# EAGLE design TinyBuddy-rev2 (EAGLE 6.5.0)
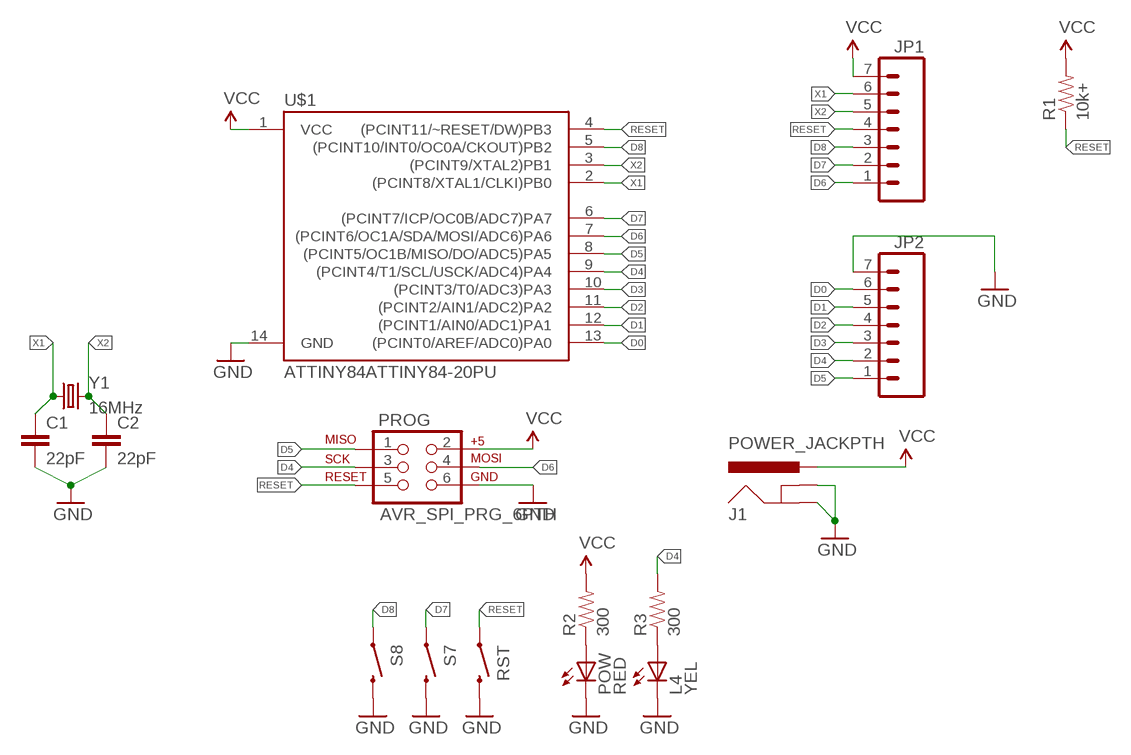
[diagram p0: schematic, sheet 1]

## Parts
C1  22pF  CAPPTH  [CAP-PTH-SMALL]
C2  22pF  CAPPTH  [CAP-PTH-SMALL]
J1  POWER_JACKPTH  [POWER_JACK_PTH]
JP1  M07NOSILK  [1X07_NOSILK]
JP2  M07NOSILK  [1X07_NOSILK]
L4  YEL  LED3MM  [LED3MM]
POW  RED  LED3MM  [LED3MM]
PROG  AVR_SPI_PRG_6PTH  [2X3]
R1  10k+  RESISTORPTH-1/6W  [1/6W-RES]
R2  300  RESISTORPTH-1/6W  [1/6W-RES]
R3  300  RESISTORPTH-1/6W  [1/6W-RES]
RST  SWITCH-MOMENTARY-2PTH  [TACTILE-PTH]
S7  SWITCH-MOMENTARY-2PTH  [TACTILE-PTH]
S8  SWITCH-MOMENTARY-2PTH  [TACTILE-PTH]
U$1  ATTINY84ATTINY84-20PU  [DIL14]
Y1  16MHz  CRYSTALHC49US  [HC49US]

## Nets
D0: JP2.6 U$1.13((PCINT0/AREF/ADC0)PA0)
D1: JP2.5 U$1.12((PCINT1/AIN0/ADC1)PA1)
D2: JP2.4 U$1.11((PCINT2/AIN1/ADC2)PA2)
D3: JP2.3 U$1.10((PCINT3/T0/ADC3)PA3)
D4: JP2.2 PROG.3 R3.2 U$1.9((PCINT4/T1/SCL/USCK/ADC4)PA4)
D5: JP2.1 PROG.1 U$1.8((PCINT5/OC1B/MISO/DO/ADC5)PA5)
D6: JP1.1 PROG.4 U$1.7((PCINT6/OC1A/SDA/MOSI/ADC6)PA6)
D7: JP1.2 S7.1 U$1.6((PCINT7/ICP/OC0B/ADC7)PA7)
D8: JP1.3 S8.1 U$1.5((PCINT10/INT0/OC0A/CKOUT)PB2)
GND: C1.2 C2.2 J1.GND J1.GNDBREAK JP2.7 L4.K(C) POW.K(C) PROG.6 RST.3 S7.3 S8.3 U$1.14(GND)
N$1: POW.A R2.1
N$2: L4.A R3.1
RESET: JP1.4 PROG.5 R1.1 RST.1 U$1.4((PCINT11/~RESET/DW)PB3)
VCC: J1.PWR JP1.7 PROG.2 R1.2 R2.2 U$1.1(VCC)
X1: C1.1 JP1.6 U$1.2((PCINT8/XTAL1/CLKI)PB0) Y1.1
X2: C2.1 JP1.5 U$1.3((PCINT9/XTAL2)PB1) Y1.2

## Library data of the parts
C1 C2 = SparkFun-Capacitors:CAP: Capacitor Standard 0603 ceramic capacitor, and 0.1" leaded capacitor.
J1 = SparkFun-Connectors:POWER_JACK: Power Jack This is the standard 5.5mm barrel jack for power. The PTH is the most common, proven, reliable, footprint. The Slot footprint only works if the mill layer is transmitted to the PCB fab house so be warned. Mating wall wart : TOL-00298 (and others); PROD_ID: PRT-00119
JP1 JP2 = SparkFun-Connectors:M07: Header 7 Standard 7-pin 0.1" header. Use with straight break away headers (SKU : PRT-00116), right angle break away headers (PRT-00553), swiss pins (PRT-00743), machine pins (PRT-00117), and female headers (PRT-00115). NOTES ON THE VARIANTS LOCK and LOCK_LONGPADS... This footprint was designed to help hold the alignment of a through-hole component (i.e. 7-pin header) while soldering it into place. You may notice that each hole has been shifted either up or down by 0.005 of an inch from it's more standard position (which is usually a perfectly straight line). This slight alteration caused the pins (the squares in the middle) to touch the edges of the holes. Because they are alternating, it causes a "brace" to hold the header in place. 0.005 has proven to be the perfect amount of "off-center" position when using our standard breakaway headers. Although looks a little odd when you look at the bare footprint, once you have a header in there, the alteration is very hard to notice. Also, if you push a header all the way into place, it is covered up entirely on the bottom side. This idea of altering the position of holes to aid alignment will be further integrated into the Sparkfun Library for other footprints. It can help hold any component with 3 or more connection pins.
L4 POW = SparkFun-LED:LED: LEDs Standard schematic elements and footprints for 5mm, 3mm, 1206, and 0603 sized LEDs. 5mm - Spark Fun Electronics SKU : COM-00529 (and others)
PROG = SparkFun-Connectors:AVR_SPI_PRG_6: AVR ISP 6 Pin This is the reduced ISP connector for AVR programming. Common on Arduino. This footprint will take up less PCB space and can be used with a 10-pin to 6-pin adapter such as SKU: BOB-08508
R1-R3 = SparkFun-Resistors:RESISTOR: Resistor Basic schematic elements and footprints for 0603, 1206, and PTH resistors.
RST S7 S8 = SparkFun-Electromechanical:SWITCH-MOMENTARY-2: Various NO switches- pushbuttons, reed, etc
U$1 = SparkFun-DigitalIC:ATTINY84: Atmel 14-pin 2/4/8kB flash uC
Y1 = SparkFun-FreqCtrl:CRYSTAL: Various standard crystals. Proven footprints. Spark Fun Electronics SKU : COM-00534

## Board
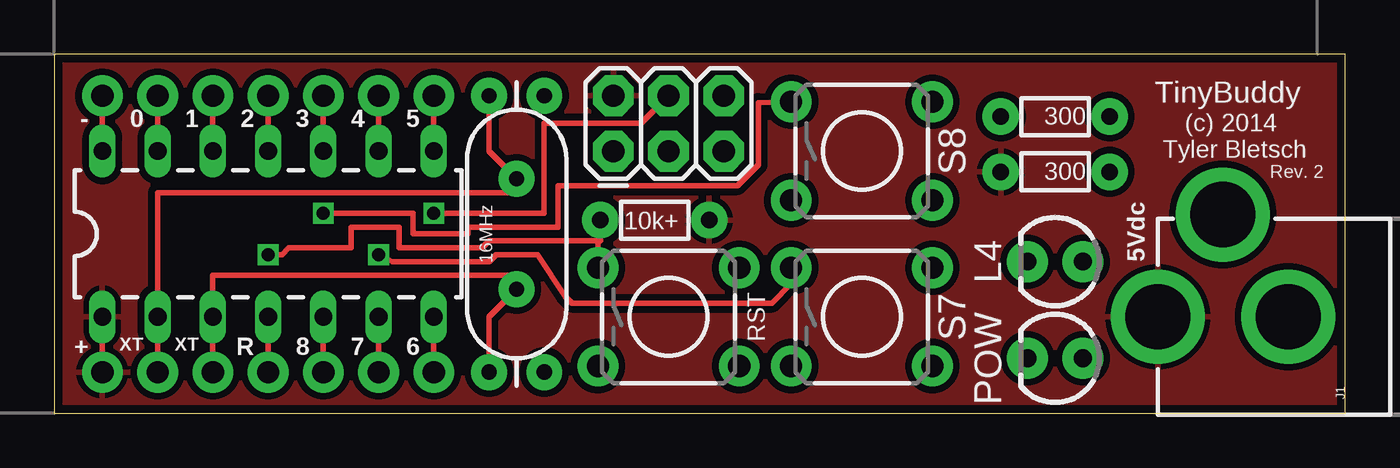
[diagram p1: board, top side]
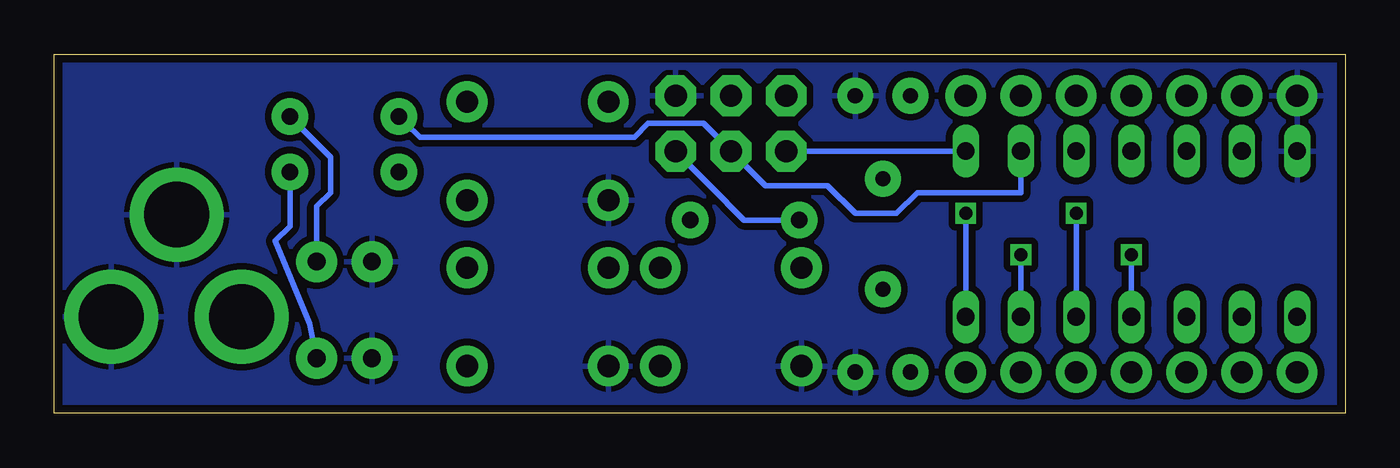
[diagram p2: board, bottom side, seen from below]

Size 59.36 x 16.5 mm. Coordinates in mm from the lower left corner, seen from the top.
Outline: 59.36,16.5 0,16.5 0,0 59.36,0 59.36,16.5
Copper layers (1*16): Top 0.0356mm / dielectric 1.5011mm / Bottom 0.0356mm
Design rules "OSH-Park-PCBOrder": minimum track width 6mil, minimum drill 13mil, track to track 6mil, track to pad 6mil, pad to pad 6mil, via to via 6mil, smd to smd 6mil, copper to edge 15mil, drill to drill 6mil, minimum pad ring 7mil, minimum via ring 7mil, stop-mask expansion 3mil, vias tented up to drill 0mil, thermal gap 10mil

### Footprints (pad centres in the part's own frame; a part is rotated, then mirrored left to right if it is on the bottom)
CAP-PTH-SMALL = drill 0.7 pad 1.651: 1 0,0; 2 2.54,0
POWER_JACK_PTH = drill 2.997 pad 4.318: GND 0,7.7; GNDBREAK 4.7,10.7; PWR 0,13.7
1X07_NOSILK = drill 1.016 pad 1.88: 1 0,0; 2 2.54,0; 3 5.08,0; 4 7.62,0; 5 10.16,0; 6 12.7,0; 7 15.24,0
LED3MM = drill 0.813 pad 1.88: A -1.27,0; K 1.27,0
2X3 = drill 1.016 pad 1.88 octagon: 1 0,0; 2 0,2.54; 3 2.54,0; 4 2.54,2.54; 5 5.08,0; 6 5.08,2.54
1/6W-RES = drill 0.762 pad 1.676: 1 -2.5,0; 2 2.5,0
TACTILE-PTH = drill 1.016 pad 1.88: 1 -3.251,2.261; 2 3.251,2.261; 3 -3.251,-2.261; 4 3.251,-2.261
DIL14 = drill 0.813 long: 1 -8.89,-3.81; 2 -6.35,-3.81; 3 -3.81,-3.81; 4 -1.27,-3.81; 5 1.27,-3.81; 6 3.81,-3.81; 7 6.35,-3.81; 8 6.35,3.81; 9 3.81,3.81; 10 1.27,3.81; 11 -1.27,3.81; 12 -3.81,3.81; 13 -6.35,3.81; 14 -8.89,3.81
HC49US = drill 0.7 pad 1.651: 1 -2.54,0; 2 2.54,0

### Placement (x,y rotation side)
C1  19.99,14.59 0 top
C2  19.99,1.89 0 top
J1  64.44,4.43 90 top
JP1  17.45,1.89 180 top
JP2  17.45,14.59 180 top
L4  46.03,6.98 180 top
POW  46.03,2.53 180 top
PROG  25.7,12.05 0 top
R1  27.61,8.88 0 top
R2  46.03,11.1 180 top
R3  46.03,13.64 180 top
RST  28.24,4.43 0 top
S7  37.13,4.43 0 top
S8  37.13,12.05 0 top
U$1  11.1,8.25 0 top
Y1  21.26,8.25 270 top

### Tracks (layer width: path | path; a pad name or v marks a point on that pad's centre or on a via)
D0
  Top 0.254: JP2.6 U$1.13
D1
  Top 0.254: JP2.5 U$1.12
D2
  Top 0.254: JP2.4 U$1.11
D3
  Top 0.254: JP2.3 U$1.10
D4
  Top 0.254: JP2.2 U$1.9
  Bottom 0.254: U$1.9 14.91,10.15 19.67,10.15 20.62,9.2 22.53,9.2 23.8,10.47 26.66,10.47 PROG.3 29.52,13.32 32.05,13.32 32.69,12.69 42.53,12.69 43.21,13.32 R3.2
D5
  Top 0.254: JP2.1 U$1.8
  Bottom 0.254: U$1.8 PROG.1
D6  (via drill 0.6)
  Top 0.254: U$1.7 JP1.1 | PROG.4 26.98,13.32 22.53,13.32 22.53,9.2 v17.45,9.2
  Bottom 0.254: v17.45,9.2 U$1.7
D7  (via drill 0.6)
  Top 0.254: U$1.6 JP1.2 | v14.91,7.29 15.55,6.98 19.99,6.98 20.31,7.29 22.21,7.29 23.48,5.39 23.8,5.07 33.01,5.07 33.88,5.95 S7.1
  Bottom 0.254: U$1.6 v14.91,7.29
D8  (via drill 0.6)
  Top 0.254: U$1.5 JP1.3 | v12.37,9.2 16.5,9.2 16.5,8.25 19.04,8.25 19.04,8.56 23.16,8.56 23.16,10.47 31.42,10.47 32.37,11.42 32.37,14.28 33.68,14.32 S8.1
  Bottom 0.254: U$1.5 v12.37,9.2
GND
  Top 0.254: JP2.7 U$1.14
  pour Bottom (isolate 0.305): 60.63,-3.18 60.63,18.4 -1.6,18.4 -1.6,-1.91
N$1
  Bottom 0.254: R2.1 48.53,8.6 49.2,7.93 47.61,4.12 POW.A
N$2
  Bottom 0.254: L4.A 47.3,9.52 46.66,10.15 46.66,11.78 R3.1
RESET  (via drill 0.6)
  Top 0.254: U$1.4 JP1.4 | v9.83,7.29 10.46,7.29 10.78,7.61 13.64,7.61 13.64,8.56 15.86,8.56 15.86,7.61 19.67,7.61 19.99,7.93 24.99,7.93 | 24.99,7.93 25.11,7.93 R1.1 | 24.99,7.93 RST.1
  Bottom 0.254: U$1.4 v9.83,7.29 | PROG.5 29.2,10.47 27.65,8.88 R1.1
VCC
  Top 0.254: U$1.1 JP1.7
  pour Top (isolate 0.305): 59.36,-1.91 -0.33,-0.64 -0.33,17.14 59.36,17.14
X1
  Top 0.254: JP1.6 U$1.2 4.75,10.15 21.26,10.15 Y1.1 19.99,12.05 C1.1
X2
  Top 0.254: JP1.5 U$1.3 7.29,6.34 21.26,6.34 Y1.2 19.99,4.43 C2.1

### Text on the board
tPlace: TinyBuddy | - | 0 | 1 | 2 | 3 | 4 | 5 | (c) 2014 / Tyler Bletsch | Rev. 2 | 5Vdc | + | XT | XT | R | 8 | 7 | 6